# EAGLE design EXT_LED (EAGLE 7.5.0)
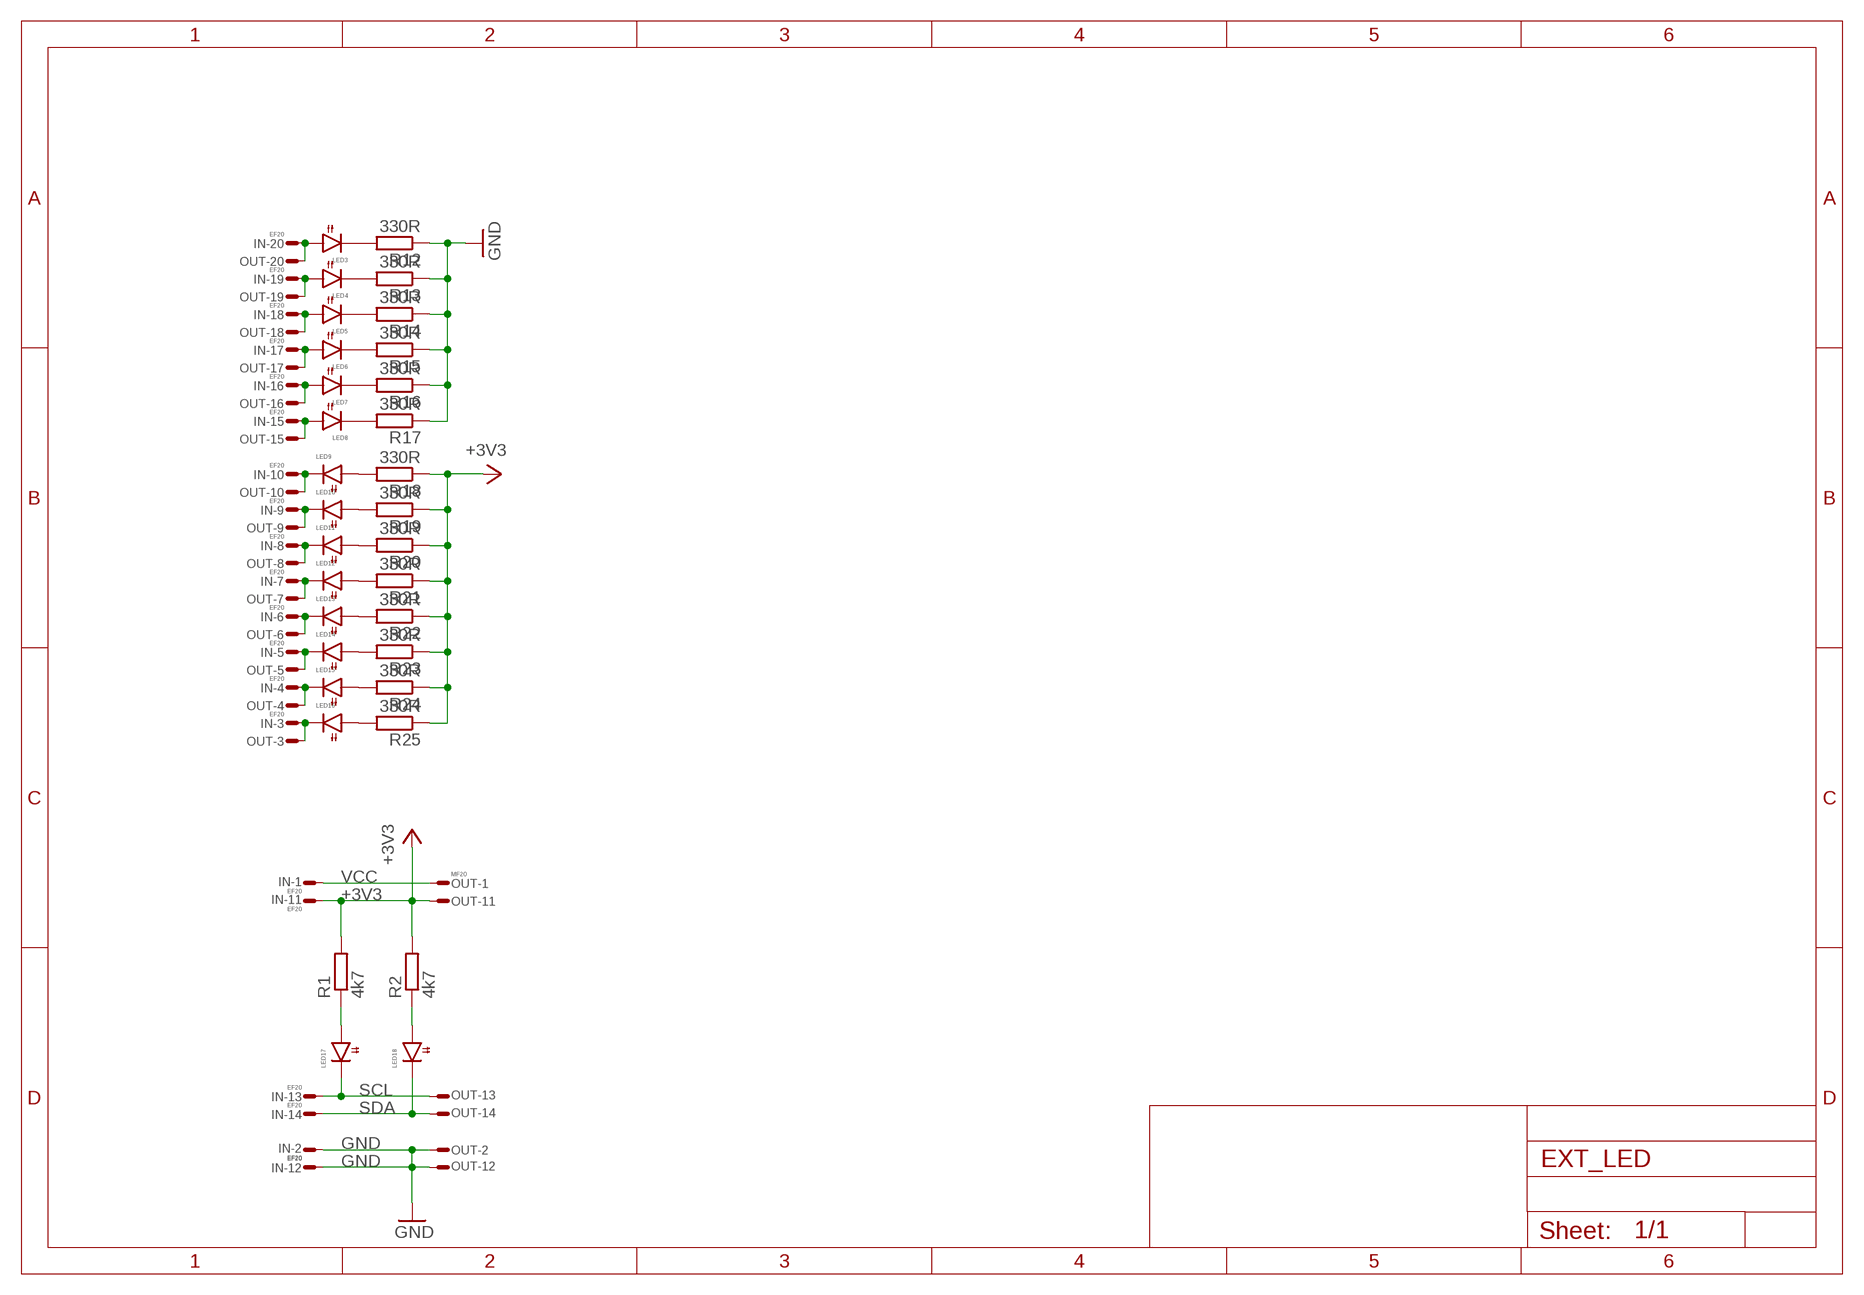
[diagram p0: schematic, sheet 1]

## Parts
IN  EF20  FE20ELSS  [FE10-2WSS]
LED3  LED0603  [0603]
LED4  LED0603  [0603]
LED5  LED0603  [0603]
LED6  LED0603  [0603]
LED7  LED0603  [0603]
LED8  LED0603  [0603]
LED9  LED0603  [0603]
LED10  LED0603  [0603]
LED11  LED0603  [0603]
LED12  LED0603  [0603]
LED13  LED0603  [0603]
LED14  LED0603  [0603]
LED15  LED0603  [0603]
LED16  LED0603  [0603]
LED17  LED0603  [0603]
LED18  LED0603  [0603]
OUT  MF20  ML20LSE  [ML20LS]
R1  4k7  R0603  [0603]
R2  4k7  R0603  [0603]
R12  330R  R0603  [0603]
R13  330R  R0603  [0603]
R14  330R  R0603  [0603]
R15  330R  R0603  [0603]
R16  330R  R0603  [0603]
R17  330R  R0603  [0603]
R18  330R  R0603  [0603]
R19  330R  R0603  [0603]
R20  330R  R0603  [0603]
R21  330R  R0603  [0603]
R22  330R  R0603  [0603]
R23  330R  R0603  [0603]
R24  330R  R0603  [0603]
R25  330R  R0603  [0603]

## Nets
+3V3: IN.P$11 OUT.P$11 R1.2 R2.2 R18.1 R19.1 R20.1 R21.1 R22.1 R23.1 R24.1 R25.1
GND: IN.P$2 IN.P$12 OUT.P$2 OUT.P$12 R12.1 R13.1 R14.1 R15.1 R16.1 R17.1
N$1: IN.P$19 LED4.1(A) OUT.P$19
N$2: IN.P$20 LED3.1(A) OUT.P$20
N$3: LED17.1(A) R1.1
N$4: LED18.1(A) R2.1
N$5: IN.P$10 LED9.2(C) OUT.P$10
N$6: LED9.1(A) R18.2
N$7: LED10.1(A) R19.2
N$8: LED11.1(A) R20.2
N$9: LED12.1(A) R21.2
N$10: LED13.1(A) R22.2
N$11: LED14.1(A) R23.2
N$12: LED15.1(A) R24.2
N$16: LED3.2(C) R12.2
N$17: LED16.1(A) R25.2
N$24: LED4.2(C) R13.2
N$25: LED5.2(C) R14.2
N$26: LED6.2(C) R15.2
N$27: LED7.2(C) R16.2
N$28: LED8.2(C) R17.2
N$32: IN.P$18 LED5.1(A) OUT.P$18
N$33: IN.P$17 LED6.1(A) OUT.P$17
N$34: IN.P$16 LED7.1(A) OUT.P$16
N$35: IN.P$15 LED8.1(A) OUT.P$15
N$45: IN.P$9 LED10.2(C) OUT.P$9
N$46: IN.P$8 LED11.2(C) OUT.P$8
N$47: IN.P$7 LED12.2(C) OUT.P$7
N$48: IN.P$6 LED13.2(C) OUT.P$6
N$49: IN.P$5 LED14.2(C) OUT.P$5
N$50: IN.P$4 LED15.2(C) OUT.P$4
N$51: IN.P$3 LED16.2(C) OUT.P$3
SCL: IN.P$13 LED17.2(C) OUT.P$13
SDA: IN.P$14 LED18.2(C) OUT.P$14
VCC: IN.P$1 OUT.P$1

## Library data of the parts
IN = Conn:FE20E
LED3-LED18 = Optic:LED
OUT = Conn:ML20?E: HARTING
R1 R2 R12-R25 = RCL:R: Resistor SMD

## Board
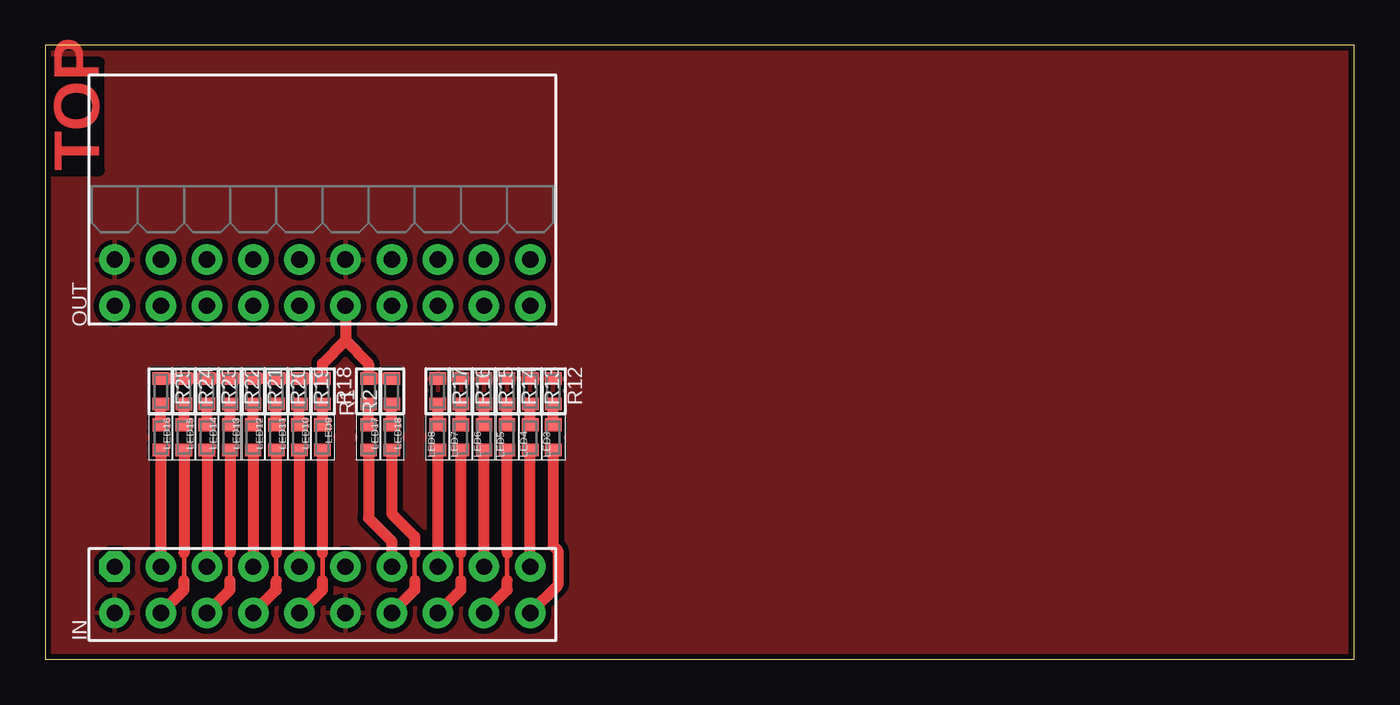
[diagram p1: board, top side]
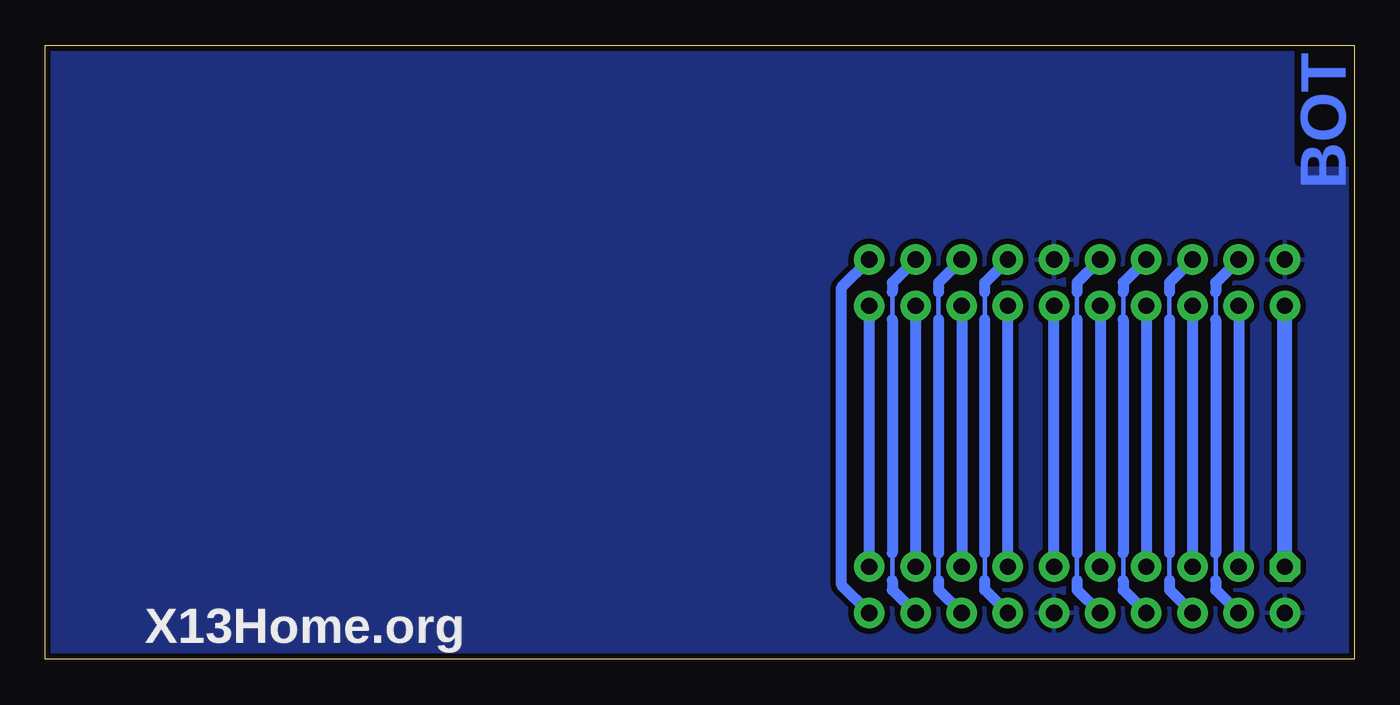
[diagram p2: board, bottom side, seen from below]

Size 72 x 33.75 mm. Coordinates in mm from the lower left corner, seen from the top.
Outline: 72,0 72,33.75 0,33.75 0,0 72,0
Copper layers (1*16): Top 0.035mm / dielectric 1.5mm / Bottom 0.035mm
Design rules "default *": minimum track width 10mil, minimum drill 10mil, track to track 12mil, track to pad 12mil, pad to pad 12mil, via to via 12mil, smd to smd 12mil, copper to edge 12mil, drill to drill 8mil, minimum pad ring 10mil, minimum via ring 8mil, stop-mask expansion 4mil, vias tented up to drill 0mil, thermal gap 10mil

### Footprints (pad centres in the part's own frame; a part is rotated, then mirrored left to right if it is on the bottom)
FE10-2WSS = drill 0.9 pad 1.676 octagon: P$1 -11.43,1.27 | drill 0.9 pad 1.676: P$2 -11.43,-1.27; P$3 -8.89,1.27; P$4 -8.89,-1.27; P$5 -6.35,1.27; P$6 -6.35,-1.27; P$7 -3.81,1.27; P$8 -3.81,-1.27; P$9 -1.27,1.27; P$10 -1.27,-1.27; P$11 1.27,1.27; P$12 1.27,-1.27; P$13 3.81,1.27; P$14 3.81,-1.27; P$15 6.35,1.27; P$16 6.35,-1.27; P$17 8.89,1.27; P$18 8.89,-1.27; P$19 11.43,1.27; P$20 11.43,-1.27
0603 = smd 0.7 x 0.9: 1 -0.697,0; 2 0.697,0
ML20LS = drill 0.9 pad 1.676: P$1 -11.43,-1.27; P$2 -11.43,1.27; P$3 -8.89,-1.27; P$4 -8.89,1.27; P$5 -6.35,-1.27; P$6 -6.35,1.27; P$7 -3.81,-1.27; P$8 -3.81,1.27; P$9 -1.27,-1.27; P$10 -1.27,1.27; P$11 1.27,-1.27; P$12 1.27,1.27; P$13 3.81,-1.27; P$14 3.81,1.27; P$15 6.35,-1.27; P$16 6.35,1.27; P$17 8.89,-1.27; P$18 8.89,1.27; P$19 11.43,-1.27; P$20 11.43,1.27

### Placement (x,y rotation side)
IN  15.24,3.81 0 top
LED3  27.94,12.19 90 top
LED4  26.67,12.19 90 top
LED5  25.4,12.19 90 top
LED6  24.13,12.19 90 top
LED7  22.86,12.19 90 top
LED8  21.59,12.19 90 top
LED9  15.24,12.19 270 top
LED10  13.97,12.19 270 top
LED11  12.7,12.19 270 top
LED12  11.43,12.19 270 top
LED13  10.16,12.19 270 top
LED14  8.89,12.19 270 top
LED15  7.62,12.19 270 top
LED16  6.35,12.19 270 top
LED17  17.78,12.19 270 top
LED18  19.05,12.19 270 top
OUT  15.24,20.7 0 top
R1  17.78,14.73 90 top
R2  19.05,14.73 90 top
R12  27.94,14.73 270 top
R13  26.67,14.73 270 top
R14  25.4,14.73 270 top
R15  24.13,14.73 270 top
R16  22.86,14.73 270 top
R17  21.59,14.73 270 top
R18  15.24,14.73 270 top
R19  13.97,14.73 270 top
R20  12.7,14.73 270 top
R21  11.43,14.73 270 top
R22  10.16,14.73 270 top
R23  8.89,14.73 270 top
R24  7.62,14.73 270 top
R25  6.35,14.73 270 top

### Tracks (layer width: path | path; a pad name or v marks a point on that pad's centre or on a via)
+3V3
  Top 0.61: OUT.P$11 16.51,17.53 | 16.51,17.53 17.78,16.26 R1.2 R2.2 | 16.51,17.53 15.24,16.26 R18.1 R19.1 R20.1 R21.1 R22.1 R23.1 R24.1 R25.1
  Bottom 0.61: IN.P$11 OUT.P$11
GND
  pour Bottom: 71.87,0 71.87,33.66 0.12,33.66 0.12,0
  pour Top: 72,0 72,33.66 0.12,33.66 0.12,0
N$1
  Top 0.61: IN.P$19 LED4.1
  Bottom 0.61: IN.P$19 OUT.P$19
N$2
  Top 0.61: LED3.1 27.94,6.22 28.19,5.97 28.19,4.06 IN.P$20
  Bottom 0.61: IN.P$20 28.19,4.06 28.19,20.45 OUT.P$20
N$3
  Top 0.61: LED17.1 R1.1
N$4
  Top 0.61: LED18.1 R2.1
N$5
  Top 0.254: 15.24,4.32 15.24,5.84
  Top 0.61: IN.P$10 15.24,3.81 15.24,4.32 | 15.24,5.84 LED9.2
  Bottom 0.254: 15.24,20.19 15.24,18.67 | 15.24,5.84 15.24,4.32
  Bottom 0.61: OUT.P$10 15.24,20.7 15.24,20.19 | 15.24,18.67 15.24,5.84 | 15.24,4.32 15.24,3.81 IN.P$10
N$6
  Top 0.61: LED9.1 R18.2
N$7
  Top 0.61: LED10.1 R19.2
N$8
  Top 0.61: LED11.1 R20.2
N$9
  Top 0.61: LED12.1 R21.2
N$10
  Top 0.61: LED13.1 R22.2
N$11
  Top 0.61: LED14.1 R23.2
N$12
  Top 0.61: LED15.1 R24.2
N$16
  Top 0.61: LED3.2 R12.2
N$17
  Top 0.61: LED16.1 R25.2
N$24
  Top 0.61: LED4.2 R13.2
N$25
  Top 0.61: LED5.2 R14.2
N$26
  Top 0.61: LED6.2 R15.2
N$27
  Top 0.61: LED7.2 R16.2
N$28
  Top 0.61: LED8.2 R17.2
N$32
  Top 0.254: 25.4,4.32 25.4,5.84
  Top 0.61: 25.4,4.32 25.4,3.81 IN.P$18 | 25.4,5.84 LED5.1
  Bottom 0.254: 25.4,20.19 25.4,18.67 | 25.4,5.84 25.4,4.32
  Bottom 0.61: OUT.P$18 25.4,20.7 25.4,20.19 | 25.4,18.67 25.4,5.84 | 25.4,4.32 25.4,3.81 IN.P$18
N$33
  Top 0.61: LED6.1 IN.P$17
  Bottom 0.61: OUT.P$17 IN.P$17
N$34
  Top 0.254: 22.86,4.32 22.86,5.84
  Top 0.61: 22.86,4.32 22.86,3.81 IN.P$16 | 22.86,5.84 LED7.1
  Bottom 0.254: 22.86,20.19 22.86,18.67 | 22.86,5.84 22.86,4.32
  Bottom 0.61: OUT.P$16 22.86,20.7 22.86,20.19 | 22.86,18.67 22.86,5.84 | 22.86,4.32 22.86,3.81 IN.P$16
N$35
  Top 0.61: LED8.1 IN.P$15
  Bottom 0.61: OUT.P$15 IN.P$15
N$45
  Top 0.61: LED10.2 IN.P$9
  Bottom 0.61: OUT.P$9 IN.P$9
N$46
  Top 0.254: 12.7,4.32 12.7,5.84
  Top 0.61: 12.7,4.32 12.7,3.81 IN.P$8 | LED11.2 12.7,5.84
  Bottom 0.254: 12.7,20.19 12.7,18.67 | 12.7,5.84 12.7,4.32
  Bottom 0.61: OUT.P$8 12.7,20.7 12.7,20.19 | 12.7,18.67 12.7,5.84 | 12.7,4.32 12.7,3.81 IN.P$8
N$47
  Top 0.61: LED12.2 IN.P$7
  Bottom 0.61: OUT.P$7 IN.P$7
N$48
  Top 0.254: 10.16,4.32 10.16,5.84
  Top 0.61: 10.16,4.32 10.16,3.81 IN.P$6 | LED13.2 10.16,5.84
  Bottom 0.254: 10.16,20.19 10.16,18.67 | 10.16,5.84 10.16,4.32
  Bottom 0.61: OUT.P$6 10.16,20.7 10.16,20.19 | 10.16,18.67 10.16,5.84 | 10.16,4.32 10.16,3.81 IN.P$6
N$49
  Top 0.61: LED14.2 IN.P$5
  Bottom 0.61: OUT.P$5 IN.P$5
N$50
  Top 0.254: 7.62,4.32 7.62,5.84
  Top 0.61: 7.62,4.32 7.62,3.81 IN.P$4 | LED15.2 7.62,5.84
  Bottom 0.254: 7.62,20.19 7.62,18.67 | 7.62,5.84 7.62,4.32
  Bottom 0.61: OUT.P$4 7.62,20.7 7.62,20.19 | 7.62,18.67 7.62,5.84 | 7.62,4.32 7.62,3.81 IN.P$4
N$51
  Top 0.61: LED16.2 IN.P$3
  Bottom 0.61: OUT.P$3 IN.P$3
SCL
  Top 0.61: LED17.2 17.78,7.75 19.05,6.48 IN.P$13
  Bottom 0.61: IN.P$13 OUT.P$13
SDA
  Top 0.254: 20.32,5.84 20.32,4.32
  Top 0.61: LED18.2 19.05,8 20.32,6.73 20.32,5.84 | 20.32,4.32 20.32,3.81 IN.P$14
  Bottom 0.254: 20.32,4.32 20.32,5.84 | 20.32,18.67 20.32,20.19
  Bottom 0.61: IN.P$14 20.32,3.81 20.32,4.32 | 20.32,5.84 20.32,18.67 | 20.32,20.19 20.32,20.7 OUT.P$14
VCC
  Bottom 0.813: IN.P$1 OUT.P$1

### Text on the board
Top: TOP
Bottom: BOT
bNames: X13Home.org